# EAGLE design IsNoTeensy++ v1.0 (EAGLE 6.1)
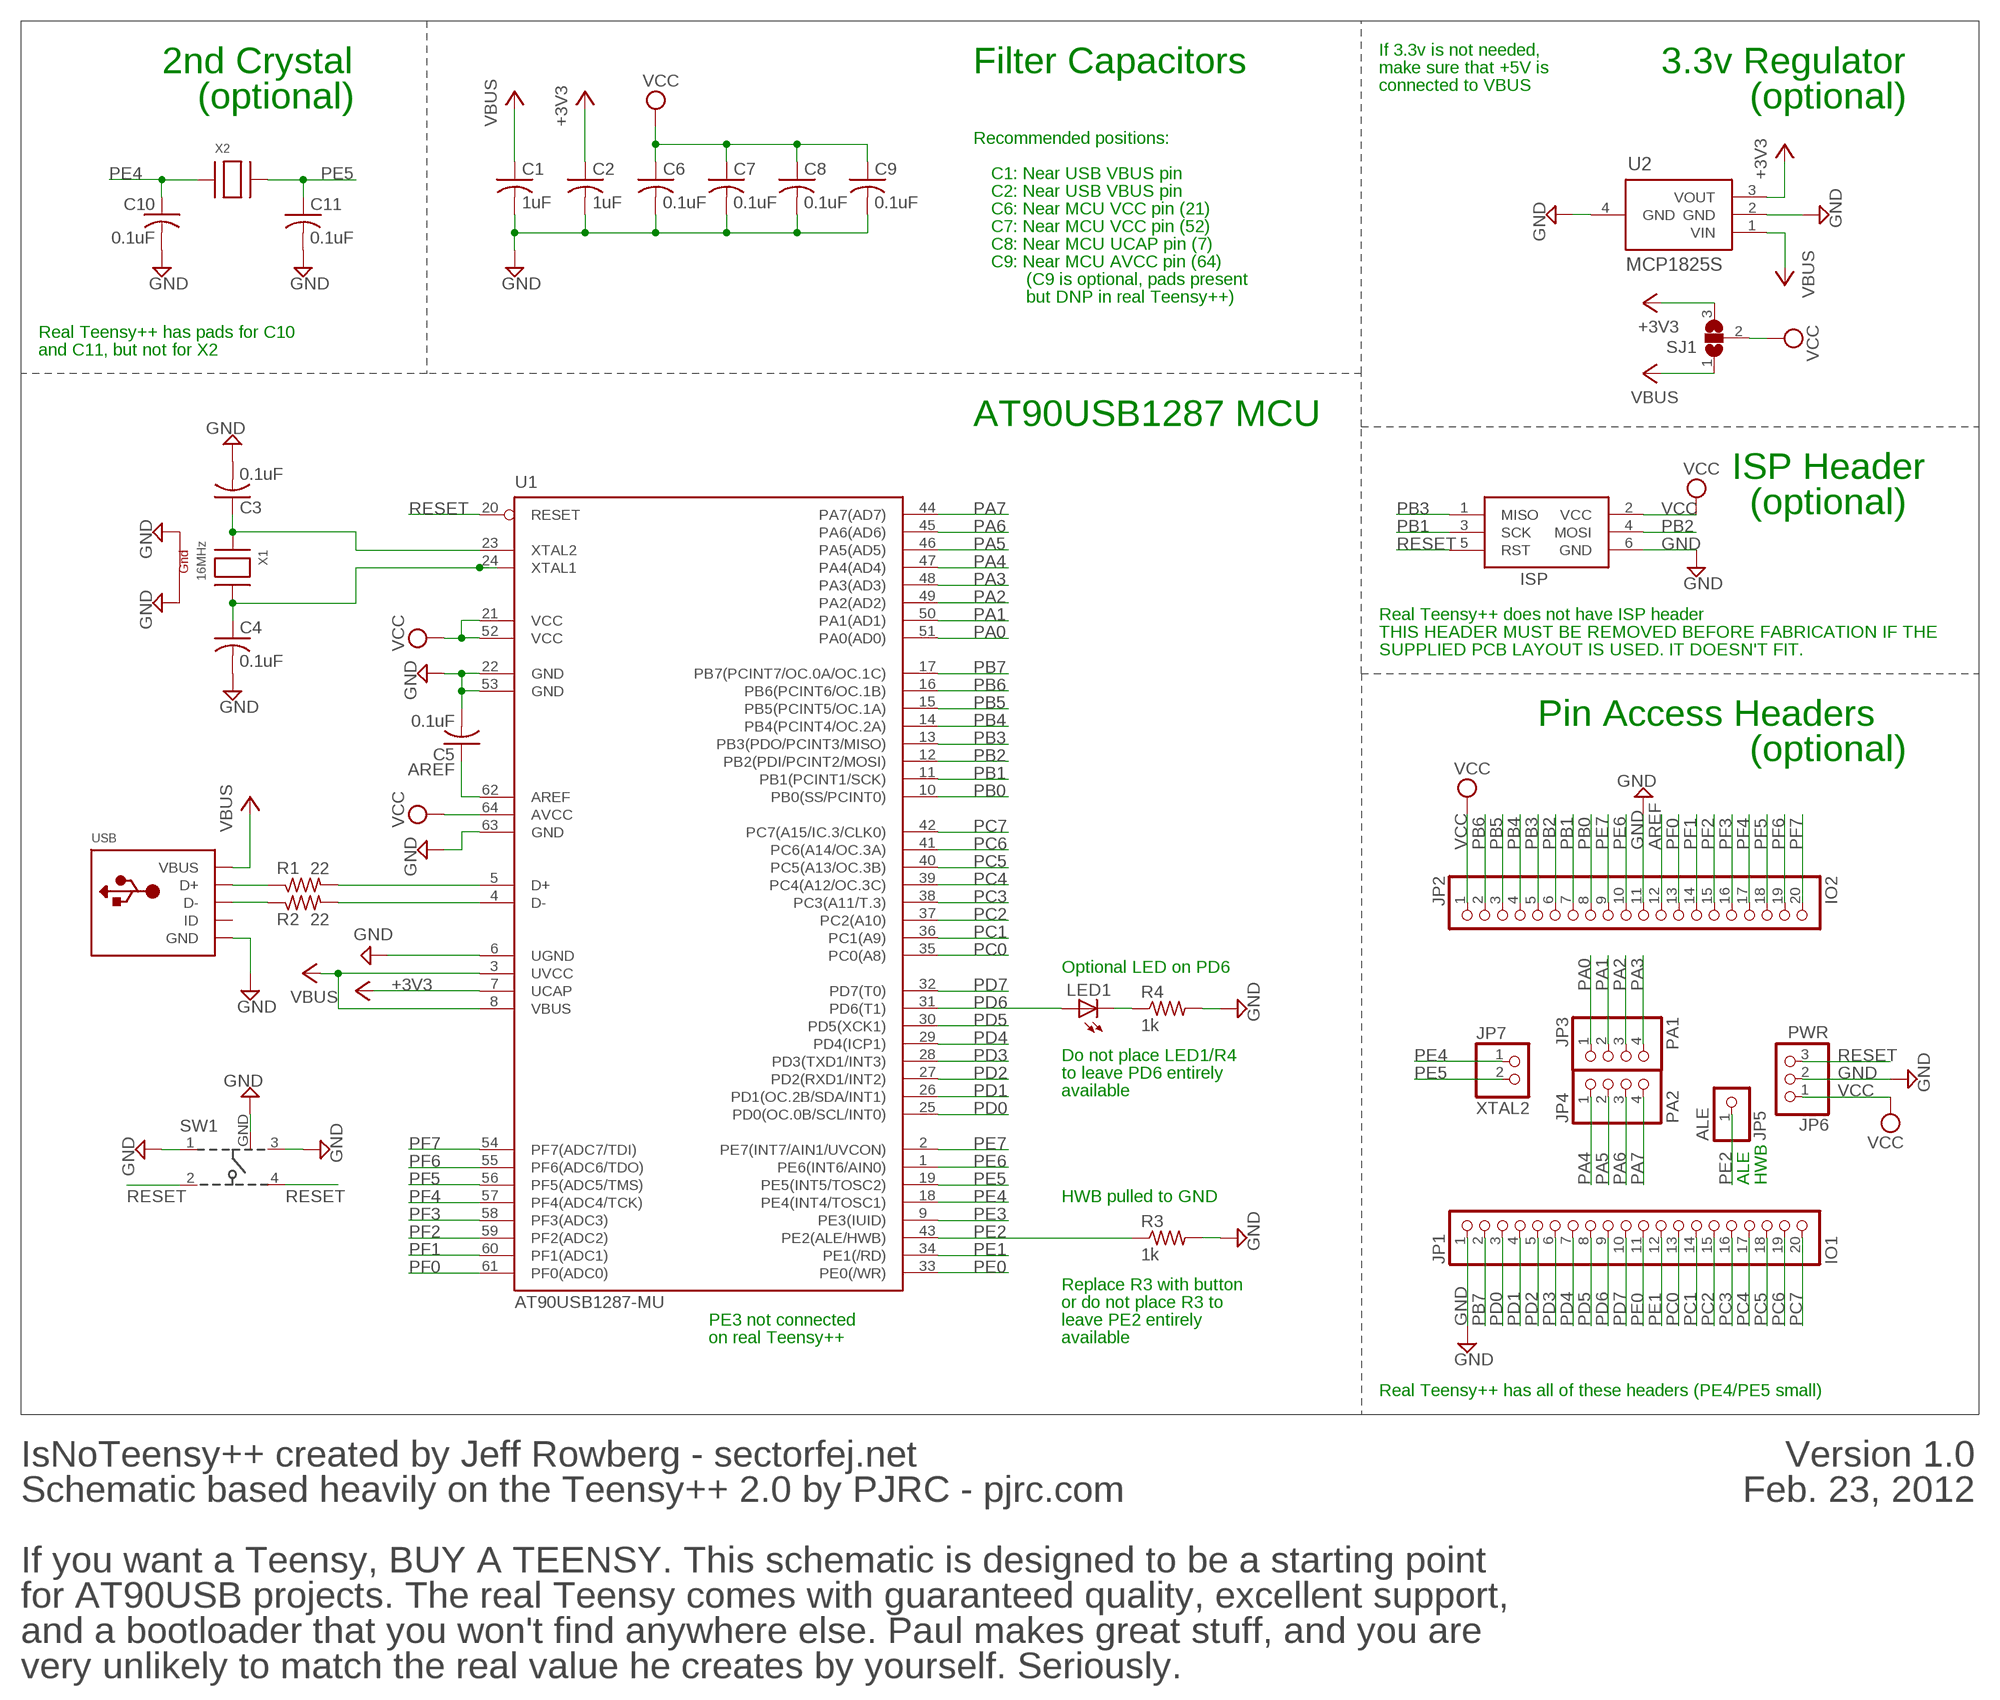
[diagram p0: schematic, sheet 1]

## Parts
C1  1uF  C-USC0603  [C0603]
C2  1uF  C-USC0603  [C0603]
C3  0.1uF  C-USC0402  [C0402]
C4  0.1uF  C-USC0402  [C0402]
C5  0.1uF  C-USC0402  [C0402]
C6  0.1uF  C-USC0402  [C0402]
C7  0.1uF  C-USC0402  [C0402]
C8  0.1uF  C-USC0402  [C0402]
C9  0.1uF  C-USC0805  [C0805]
C10  0.1uF  C-USC0805  [C0805]
C11  0.1uF  C-USC0805  [C0805]
ISP  AVRISP-6  [AVRISP]
JP1  IO1  PINHD-1X20  [1X20]
JP2  IO2  PINHD-1X20  [1X20]
JP3  PA1  PINHD-1X4  [1X04]
JP4  PA2  PINHD-1X4  [1X04]
JP5  ALE  PINHD-1X1  [1X01]
JP6  PWR  PINHD-1X3  [1X03]
JP7  XTAL2  PINHD-1X2  [1X02]
LED1  LEDCHIP-LED0603  [CHIP-LED0603]
R1  22  R-US_R0402  [R0402]
R2  22  R-US_R0402  [R0402]
R3  1k  R-US_R0402  [R0402]
R4  1k  R-US_R0402  [R0402]
SJ1  SJ2W  [SJ_2]
SW1  101-IG  [101-IG]
U1  AT90USB1287-MU  [MLF64]
U2  MCP1825S  [SOT223]
USB  USBMINIB  [USB-MINIB]
X1  16MHz  XTAL-4-3225  [NX3225]
X2  XTAL-3.2X1.5  [XTAL3215]

## Nets
+3V3: C2.1 SJ1.3 U1.7(UCAP) U2.3(VOUT)
AREF: C5.1 JP2.12 U1.62(AREF)
D+: R1.2 U1.5(D+)
D-: R2.2 U1.4(D-)
GND: C1.2 C2.2 C3.2 C4.2 C5.2 C6.2 C7.2 C8.2 C9.2 C10.2 C11.2 ISP.6(GND) JP1.1 JP2.11 JP6.2 R3.2 R4.2 SW1.1 SW1.3 SW1.GND U1.6(UGND) U1.22(GND) U1.53(GND) U1.63(GND) U2.2(GND) U2.4(GND) USB.GND USB.GND1(GND) USB.GND2(GND) USB.GND3(GND) USB.GND4(GND) X1.2(G1) X1.4(G2)
N$2: LED1.C R4.1
N$5: R1.1 USB.D+
N$14: R2.1 USB.D-
N$17: C4.1 U1.24(XTAL1) X1.3(X2)
N$18: C3.1 U1.23(XTAL2) X1.1(X1)
PA0: JP3.1 U1.51(PA0(AD0))
PA1: JP3.2 U1.50(PA1(AD1))
PA2: JP3.3 U1.49(PA2(AD2))
PA3: JP3.4 U1.48(PA3(AD3))
PA4: JP4.1 U1.47(PA4(AD4))
PA5: JP4.2 U1.46(PA5(AD5))
PA6: JP4.3 U1.45(PA6(AD6))
PA7: JP4.4 U1.44(PA7(AD7))
PB0: JP2.8 U1.10(PB0(SS/PCINT0))
PB1: ISP.3(SCK) JP2.7 U1.11(PB1(PCINT1/SCK))
PB2: ISP.4(MOSI) JP2.6 U1.12(PB2(PDI/PCINT2/MOSI))
PB3: ISP.1(MISO) JP2.5 U1.13(PB3(PDO/PCINT3/MISO))
PB4: JP2.4 U1.14(PB4(PCINT4/OC.2A))
PB5: JP2.3 U1.15(PB5(PCINT5/OC.1A))
PB6: JP2.2 U1.16(PB6(PCINT6/OC.1B))
PB7: JP1.2 U1.17(PB7(PCINT7/OC.0A/OC.1C))
PC0: JP1.13 U1.35(PC0(A8))
PC1: JP1.14 U1.36(PC1(A9))
PC2: JP1.15 U1.37(PC2(A10))
PC3: JP1.16 U1.38(PC3(A11/T.3))
PC4: JP1.17 U1.39(PC4(A12/OC.3C))
PC5: JP1.18 U1.40(PC5(A13/OC.3B))
PC6: JP1.19 U1.41(PC6(A14/OC.3A))
PC7: JP1.20 U1.42(PC7(A15/IC.3/CLK0))
PD0: JP1.3 U1.25(PD0(OC.0B/SCL/INT0))
PD1: JP1.4 U1.26(PD1(OC.2B/SDA/INT1))
PD2: JP1.5 U1.27(PD2(RXD1/INT2))
PD3: JP1.6 U1.28(PD3(TXD1/INT3))
PD4: JP1.7 U1.29(PD4(ICP1))
PD5: JP1.8 U1.30(PD5(XCK1))
PD6: JP1.9 LED1.A U1.31(PD6(T1))
PD7: JP1.10 U1.32(PD7(T0))
PE0: JP1.11 U1.33(PE0(/WR))
PE1: JP1.12 U1.34(PE1(/RD))
PE2: JP5.1 R3.1 U1.43(PE2(ALE/HWB))
PE3: U1.9(PE3(IUID))
PE4: C10.1 JP7.1 U1.18(PE4(INT4/TOSC1)) X2.P$1
PE5: C11.1 JP7.2 U1.19(PE5(INT5/TOSC2)) X2.P$2
PE6: JP2.10 U1.1(PE6(INT6/AIN0))
PE7: JP2.9 U1.2(PE7(INT7/AIN1/UVCON))
PF0: JP2.13 U1.61(PF0(ADC0))
PF1: JP2.14 U1.60(PF1(ADC1))
PF2: JP2.15 U1.59(PF2(ADC2))
PF3: JP2.16 U1.58(PF3(ADC3))
PF4: JP2.17 U1.57(PF4(ADC4/TCK))
PF5: JP2.18 U1.56(PF5(ADC5/TMS))
PF6: JP2.19 U1.55(PF6(ADC6/TDO))
PF7: JP2.20 U1.54(PF7(ADC7/TDI))
RESET: ISP.5(RST) JP6.3 SW1.2 SW1.4 U1.20(RESET)
VBUS: C1.1 SJ1.1 U1.3(UVCC) U1.8(VBUS) U2.1(VIN) USB.VBUS
VCC: C6.1 C7.1 C8.1 C9.1 ISP.2(VCC) JP2.1 JP6.1 SJ1.2 U1.21(VCC) U1.52(VCC) U1.64(AVCC)
Unconnected: USB.ID

## Notes on the sheet
- If 3.3v is not needed,
- 2nd Crystal | Filter Capacitors | make sure that +5V is | 3.3v Regulator
- connected to VBUS
- (optional) | (optional)
- Recommended positions:
- C1: Near USB VBUS pin
- C2: Near USB VBUS pin
- C6: Near MCU VCC pin (21)
- C7: Near MCU VCC pin (52)
- C8: Near MCU UCAP pin (7)
- C9: Near MCU AVCC pin (64)
- (C9 is optional, pads present
- but DNP in real Teensy++)
- Real Teensy++ has pads for C10
- and C11, but not for X2
- AT90USB1287 MCU
- ISP Header
- (optional)
- Real Teensy++ does not have ISP header
- THIS HEADER MUST BE REMOVED BEFORE FABRICATION IF THE
- SUPPLIED PCB LAYOUT IS USED. IT DOESN'T FIT.
- Pin Access Headers
- (optional)
- Optional LED on PD6
- Do not place LED1/R4
- to leave PD6 entirely
- available
- ALE | HWB
- HWB pulled to GND
- Replace R3 with button
- or do not place R3 to
- PE3 not connected | leave PE2 entirely
- on real Teensy++ | available
- Real Teensy++ has all of these headers (PE4/PE5 small)
- Version 1.0
- IsNoTeensy++ created by Jeff Rowberg - sectorfej.net | Feb. 23, 2012
- Schematic based heavily on the Teensy++ 2.0 by PJRC - pjrc.com
- If you want a Teensy, BUY A TEENSY. This schematic is designed to be a starting point
- for AT90USB projects. The real Teensy comes with guaranteed quality, excellent support,
- and a bootloader that you won't find anywhere else. Paul makes great stuff, and you are
- very unlikely to match the real value he creates by yourself. Seriously.

## Library data of the parts
C1-C11 = resistor:C-US: CAPACITOR, American symbol
ISP = adafruit:AVRISP: AVR ISP HEADER Standard 6 pin header for AVR programming
JP1 JP2 = sf-pinhead:PINHD-1X20: PIN HEADER
JP3 JP4 = sf-pinhead:PINHD-1X4: PIN HEADER
JP5 = sf-pinhead:PINHD-1X1: PIN HEADER
JP6 = sf-pinhead:PINHD-1X3: PIN HEADER
JP7 = sf-pinhead:PINHD-1X2: PIN HEADER
LED1 = led:LED: LED OSRAM: - CHIPLED LG R971, LG N971, LY N971, LG Q971, LY Q971, LO R971, LY R971 LH N974, LH R974 LS Q976, LO Q976, LY Q976 LO Q996 - Hyper CHIPLED LW Q18S LB Q993, LB Q99A, LB R99A - SideLED LS A670, LO A670, LY A670, LG A670, LP A670 LB A673, LV A673, LT A673, LW A673 LH A674 LY A675 LS A676, LA A676, LO A676, LY A676, LW A676 LS A679, LY A679, LG A679 - Hyper Micro SIDELED® LS Y876, LA Y876, LO Y876, LY Y876 LT Y87S - SmartLED LW L88C, LW L88S LB L89C, LB L89S, LG L890 LS L89K, LO L89K, LY L89K LS L896, LA L896, LO L896, LY L896 - TOPLED LS T670, LO T670, LY T670, LG T670, LP T670 LSG T670, LSP T670, LSY T670, LOP T670, LYG T670 LG T671, LOG T671, LSG T671 LB T673, LV T673, LT T673, LW T673 LH T674 LS T676, LA T676, LO T676, LY T676, LB T676, LH T676, LSB T676, LW T676 LB T67C, LV T67C, LT T67C, LS T67K, LO T67K, LY T67K, LW E67C LS E67B, LA E67B, LO E67B, LY E67B, LB E67C, LV E67C, LT E67C LW T67C LS T679, LY T679, LG T679 LS T770, LO T770, LY T770, LG T770, LP T770 LB T773, LV T773, LT T773, LW T773 LH T774 LS E675, LA E675, LY E675, LS T675 LS T776, LA T776, LO T776, LY T776, LB T776 LHGB T686 LT T68C, LB T68C - Hyper Mini TOPLED® LB M676 - Mini TOPLED Santana® LG M470 LS M47K, LO M47K, LY M47K Source: http://www.osram.convergy.de LUXEON: - LUMILED® LXK2-PW12-R00, LXK2-PW12-S00, LXK2-PW14-U00, LXK2-PW14-V00 LXK2-PM12-R00, LXK2-PM12-S00, LXK2-PM14-U00 LXK2-PE12-Q00, LXK2-PE12-R00, LXK2-PE12-S00, LXK2-PE14-T00, LXK2-PE14-U00 LXK2-PB12-K00, LXK2-PB12-L00, LXK2-PB12-M00, LXK2-PB14-N00, LXK2-PB14-P00, LXK2-PB14-Q00 LXK2-PR12-L00, LXK2-PR12-M00, LXK2-PR14-Q00, LXK2-PR14-R00 LXK2-PD12-Q00, LXK2-PD12-R00, LXK2-PD12-S00 LXK2-PH12-R00, LXK2-PH12-S00 LXK2-PL12-P00, LXK2-PL12-Q00, LXK2-PL12-R00 Source: www.luxeon.com KINGBRIGHT: KA-3528ASYC Source: www.kingbright.com
R1-R4 = resistor:R-US_: RESISTOR, American symbol
SJ1 = jumper:SJ2W: SMD solder JUMPER
SW1 = sf-keyglove:101-IG
U1 = at90usb:AT90USB1287-*: Atmel AT90USB1287 AVR Microcontroller with USB Interface and 128kB Flash Memory
U2 = sf-keyglove:MCP1825S
USB = adafruit:USB: USB Connectors USBMINIB - Surface Mount Female Mini-B USB Connector 4UConnector: 06564 By microbuilder.eu Thru-hole RA Female Mini-B USB Connector 4UConnector: 18732 By ladyada.net
X1 = adafruit:XTAL-4: Classic 4-pin 3.2 x 2.5mm crystal
X2 = adafruit:XTAL: Low cost SMT crystals, no capacitors included http://www.ladyada.net/library/eagle

## Net classes
0 default: width 0.152 mm, drill 0.33 mm, clearance 0.152 mm

## Board
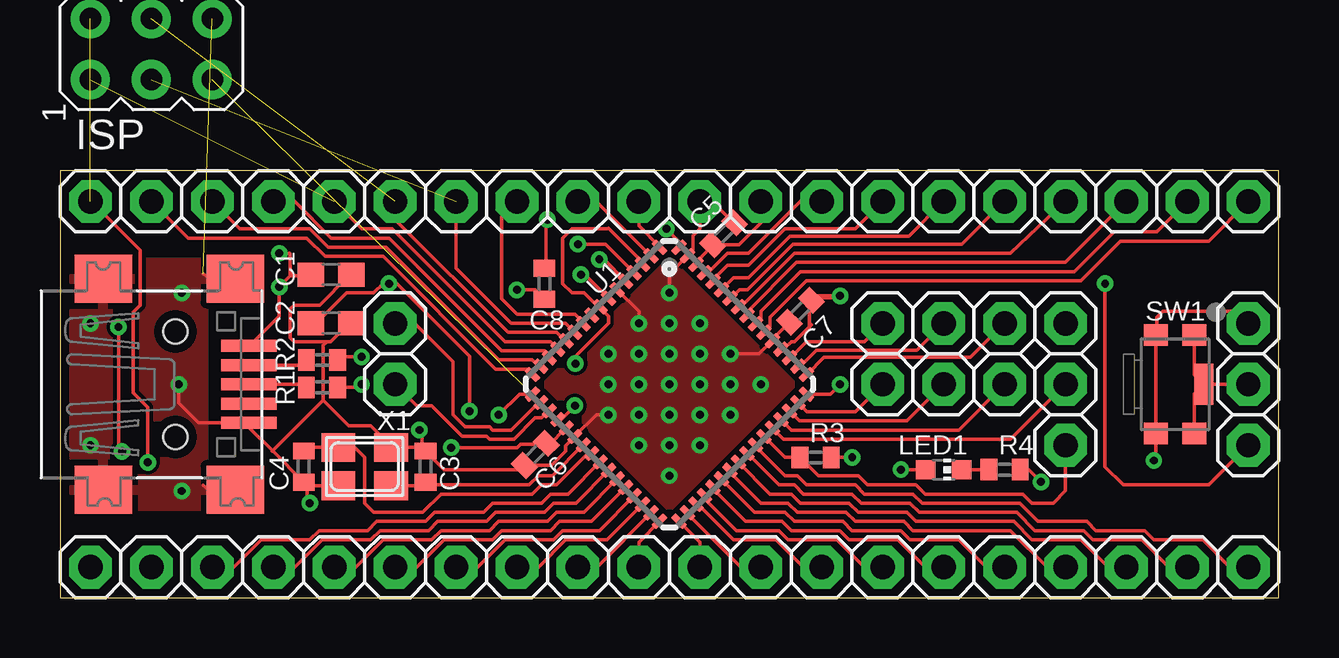
[diagram p1: board, top side]
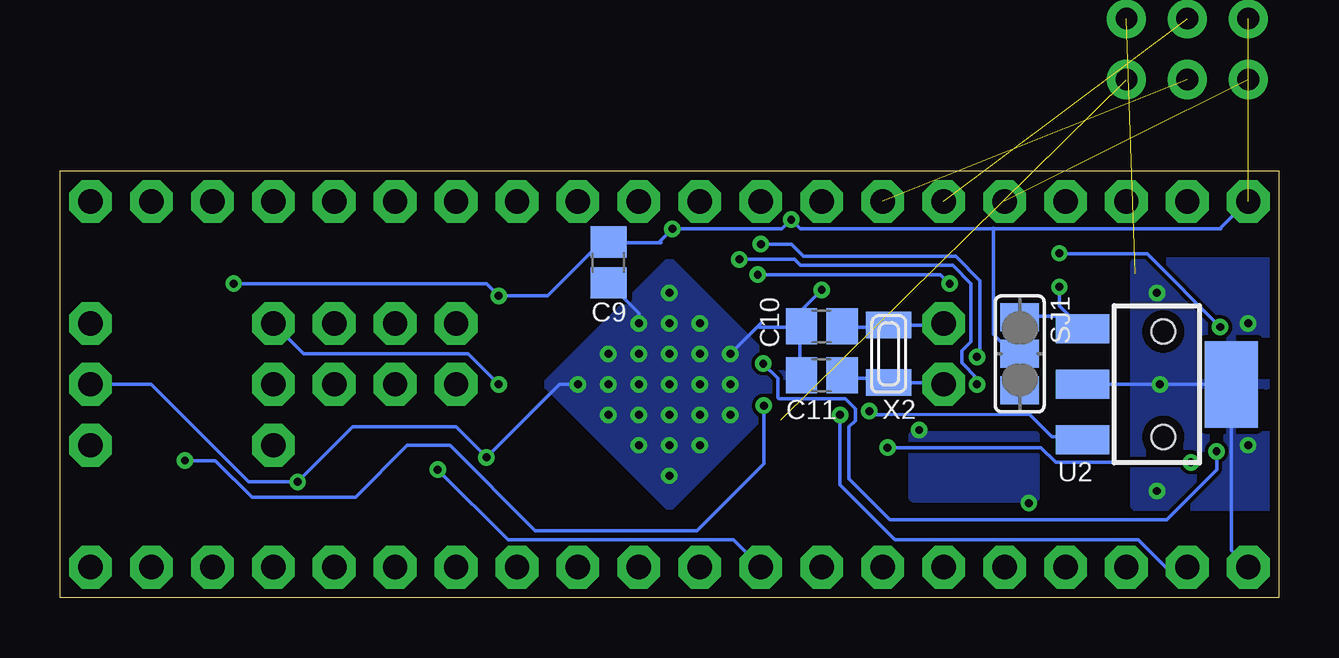
[diagram p2: board, bottom side, seen from below]

Size 50.8 x 17.78 mm. Coordinates in mm from the lower left corner, seen from the top.
Outline: 0,0 50.8,0 50.8,17.78 0,17.78 0,0
Copper layers (1*16): Top 0.0356mm / dielectric 1.5011mm / Bottom 0.0356mm
Design rules: minimum track width 6mil, minimum drill 13mil, track to track 6mil, track to pad 6mil, pad to pad 6mil, via to via 6mil, smd to smd 6mil, copper to edge 15mil, drill to drill 6mil, minimum pad ring 7mil, minimum via ring 7mil, stop-mask expansion 4mil, vias tented up to drill 20mil, thermal gap 10mil

### Footprints (pad centres in the part's own frame; a part is rotated, then mirrored left to right if it is on the bottom)
C0603 = smd 1.1 x 1: 1 -0.85,0; 2 0.85,0
C0402 = smd 0.7 x 0.9: 1 -0.65,0; 2 0.65,0
C0805 = smd 1.3 x 1.5: 1 -0.85,0; 2 0.85,0
AVRISP = drill 0.9 pad 1.626: 1 -1.27,2.54; 2 1.27,2.54; 3 -1.27,0; 4 1.27,0; 5 -1.27,-2.54; 6 1.27,-2.54
1X20 = drill 1.016 pad 1.778 octagon: 1 -24.13,0; 2 -21.59,0; 3 -19.05,0; 4 -16.51,0; 5 -13.97,0; 6 -11.43,0; 7 -8.89,0; 8 -6.35,0; 9 -3.81,0; 10 -1.27,0; 11 1.27,0; 12 3.81,0; 13 6.35,0; 14 8.89,0; 15 11.43,0; 16 13.97,0; 17 16.51,0; 18 19.05,0; 19 21.59,0; 20 24.13,0
1X04 = drill 1.016 pad 1.778 octagon: 1 -3.81,0; 2 -1.27,0; 3 1.27,0; 4 3.81,0
1X01 = drill 1.016 pad 1.778 octagon: 1 0,0
1X03 = drill 1.016 pad 1.778 octagon: 1 -2.54,0; 2 0,0; 3 2.54,0
1X02 = drill 1.016 pad 1.778 octagon: 1 -1.27,0; 2 1.27,0
CHIP-LED0603 = smd 0.8 x 0.8: A 0,-0.75; C 0,0.75
R0402 = smd 0.7 x 0.9: 1 -0.65,0; 2 0.65,0
SJ_2 = smd 1.168 x 1.6: 1 -1.524,0; 2 0,0; 3 1.524,0
101-IG = smd 0.9 x 1: 1 -2.05,0.8; 2 -2.05,-0.8; 3 2.05,0.8; 4 2.05,-0.8 | smd 1.7 x 0.8: GND 0,1.2
MLF64 = smd 0.7 x 0.3: 1 -4.325,3.75; 2 -4.325,3.25; 3 -4.325,2.75; 4 -4.325,2.25; 5 -4.325,1.75; 6 -4.325,1.25; 7 -4.325,0.75; 8 -4.325,0.25; 9 -4.325,-0.25; 10 -4.325,-0.75; 11 -4.325,-1.25; 12 -4.325,-1.75; 13 -4.325,-2.25; 14 -4.325,-2.75; 15 -4.325,-3.25; 16 -4.325,-3.75; 33 4.325,-3.75; 34 4.325,-3.25; 35 4.325,-2.75; 36 4.325,-2.25; 37 4.325,-1.75; 38 4.325,-1.25; 39 4.325,-0.75; 40 4.325,-0.25; 41 4.325,0.25; 42 4.325,0.75; 43 4.325,1.25; 44 4.325,1.75; 45 4.325,2.25; 46 4.325,2.75; 47 4.325,3.25; 48 4.325,3.75 | smd 0.3 x 0.7: 17 -3.75,-4.325; 18 -3.25,-4.325; 19 -2.75,-4.325; 20 -2.25,-4.325; 21 -1.75,-4.325; 22 -1.25,-4.325; 23 -0.75,-4.325; 24 -0.25,-4.325; 25 0.25,-4.325; 26 0.75,-4.325; 27 1.25,-4.325; 28 1.75,-4.325; 29 2.25,-4.325; 30 2.75,-4.325; 31 3.25,-4.325; 32 3.75,-4.325; 49 3.75,4.325; 50 3.25,4.325; 51 2.75,4.325; 52 2.25,4.325; 53 1.75,4.325; 54 1.25,4.325; 55 0.75,4.325; 56 0.25,4.325; 57 -0.25,4.325; 58 -0.75,4.325; 59 -1.25,4.325; 60 -1.75,4.325; 61 -2.25,4.325; 62 -2.75,4.325; 63 -3.25,4.325; 64 -3.75,4.325
SOT223 = smd 1.219 x 2.235: 1 -2.311,-3.099; 2 0,-3.099; 3 2.311,-3.099 | smd 3.6 x 2.2: 4 0,3.099
USB-MINIB = smd 0.5 x 2.308: D+ 0,4.064; D- -0.8,4.064; GND 1.6,4.064; ID 0.8,4.064; VBUS -1.6,4.064 | smd 2 x 2.4: GND1 -4.4,-2; GND2 -4.4,3.5; GND3 4.4,3.5; GND4 4.4,-2 | hole 1: -2.2,1; 2.2,1
NX3225 = smd 1.4 x 1.2: 1 -1.1,0.8; 2 1.1,0.8; 3 1.1,-0.8; 4 -1.1,-0.8
XTAL3215 = smd 1.1 x 1.9: P$1 1.2,0; P$2 -1.2,0

### Placement (x,y rotation side)
C1  11.3,13.46 0 top
C2  11.3,11.43 0 top
C3  15.24,5.46 90 top
C4  10.16,5.46 270 top
C5  27.66,15.16 45 top
C6  19.81,5.97 225 top
C7  30.86,11.94 225 top
C8  20.19,13.08 270 top
C9  27.94,13.97 270 bottom
C10  19.05,11.3 180 bottom
C11  19.05,9.27 180 bottom
ISP  3.81,22.86 90 top  (outside the outline)
JP1  25.4,1.27 0 top
JP2  25.4,16.51 0 top
JP3  38.1,11.43 0 top
JP4  38.1,8.89 0 top
JP5  41.91,6.35 0 top
JP6  49.53,8.89 90 top
JP7  13.97,10.16 270 top
LED1  36.83,5.33 270 top
R1  10.92,8.76 0 top
R2  10.92,9.91 0 top
R3  31.5,5.84 0 top
R4  39.37,5.33 0 top
SJ1  10.79,10.16 270 bottom
SW1  46.48,8.89 270 top
U1  25.4,8.89 315 top
U2  5.08,8.89 270 bottom
USB  3.81,8.89 270 top
X1  12.7,5.46 180 top
X2  16.26,10.16 90 bottom

### Tracks (layer width: path | path; a pad name or v marks a point on that pad's centre or on a via)
+3V3  (via drill 0.33)
  Top 0.152: U1.7 21.89,13.46 v21.72,13.46 | C2.1 10.67,11.43 11.94,12.7 13.08,12.7 13.46,13.08 v13.72,13.08 14.05,13.08 17.07,10.06 v17.07,7.77
  Bottom 0.152: 7.52,6.58 U2.3 8.23,6.71 9.45,6.71 10.39,7.64 10.79,7.64 | v21.72,13.46 14.1,13.46 v13.72,13.08 | v17.07,7.77 16.92,7.62 16.51,7.62 10.79,7.64 | SJ1.3 | SJ1.3 10.79,7.64
AREF
  Top 0.152: U1.62 26.51,13.94 C5.1 28.29,14.7 29.21,15.62 JP2.12
D+  (via drill 0.33)
  Top 0.152: 22.54,14.22 v22.48,14.1 22.67,14.1 U1.5 | R1.2 12.32,8.76 v12.57,8.89
  Bottom 0.152: v12.57,8.89 12.57,9.14 13.21,9.78 13.21,10.29 12.83,10.67 12.83,13.08 13.59,13.84 19.94,13.84 20.19,14.1 v22.48,14.1
D-  (via drill 0.33)
  Top 0.152: U1.4 22.74,14.73 v21.59,14.73 | R2.2 11.7,10.03 v12.57,10.03
  Bottom 0.152: v12.57,10.03 12.45,10.16 12.45,13.21 13.46,14.22 19.81,14.22 20.32,14.73 v21.59,14.73
GND  (via drill 0.33)  (1 unrouted)
  Top 0.152: JP6.2 SW1.GND | SW1.GND 47.68,8.84 | R4.2 40.39,5.33 v40.89,4.83 | R3.2 v33.02,5.84 | SW1.1 47.28,9.29 SW1.GND | SW1.3 47.28,8.49 SW1.GND | v27.94,10.16 29.14,10.16 U1.53 29.7,10.77 C7.2 | C5.2 28.11,15.57 27.18,16.51 JP2.11 26.67,15.37 26.39,15.09 26.39,14.5 U1.63 25.4,13.49 v25.4,12.7 | v22.86,7.62 22.36,7.62 U1.22 21.08,6.34 21.08,6.1 20.5,5.51 C6.2 19.53,5.33 16.02,5.33 C3.2 15.09,6.26 | 10.31,4.66 C4.2 8.86,6.11 | 10.31,4.66 X1.2 11.9,4.66 | U1.6 24.13,11.93 v24.13,11.43 | C8.2 19.8,12.83 v19.05,12.83 | v4.95,8.89 4.95,8.13 5.79,7.29 USB.GND 7.87,7.1 8.86,6.11 | X1.4 15.09,6.26 | 13.21,5.97 13.51,5.97 X1.4 | 15.09,6.26 15.09,6.83 v14.99,6.99 | 11.12,10.67 11.28,10.67 12.04,11.43 C2.2 | 11.12,10.67 10.97,10.52 10.97,8.23 | 8.86,6.11 10.97,8.23 | 8.84,6.1 8.86,6.11 | 11.12,10.67 9.75,10.67 9.6,10.82 9.6,12.04 9.75,12.19 10.82,12.19 12.04,13.41 C1.2 | 10.31,4.66 10.31,4.04 v10.41,3.94 | 10.97,8.23 12.04,7.16 12.95,7.16 13.72,6.4 X1.4 | USB.GND3 7.16,4.57 6.1,4.57 5.97,4.69 | 5.97,13.49 6.1,13.41 7.16,13.41 USB.GND2
  Bottom 0.152: JP6.2 46.99,8.89 42.93,4.83 v40.89,4.83 38.61,7.11 34.29,7.11 v33.02,5.84 29.97,8.89 v29.21,8.89 | C9.2 26.67,11.85 v26.67,11.43 | JP1.1 1.98,1.98 U2.4 v4.95,8.89 U2.2 | 21.59,11.43 21.69,11.33 | 21.69,11.33 v22.86,10.16 | v19.05,12.83 19.9,11.98 C10.2 19.96,11.28 | 19.96,11.28 19.96,9.3 C11.2 | 19.96,11.28 21.64,11.28 21.69,11.33
  other vias: 24.13,8.89 25.4,11.43 26.67,10.16 25.4,10.16 24.13,10.16 22.86,8.89 25.4,8.89 26.67,8.89 27.94,8.89 27.94,7.62 26.67,7.62 25.4,7.62 24.13,7.62 24.13,6.35 25.4,6.35 26.67,6.35 25.4,5.08 5.08,4.45 5.08,12.7 1.27,11.43 1.27,6.35
  pour Bottom: 20.32,8.89 25.4,13.97 30.48,8.89 25.4,3.81
  pour Top: 20.32,8.89 25.4,13.97 30.48,8.89 25.4,3.81
  pour Bottom: 10.16,6.73 15.24,6.73 15.24,4.19 10.16,4.19
  pour Bottom: 0,13.97 0,3.81 5.97,3.81 5.97,13.97
  pour Top: 0,3.81 0,13.97 5.97,13.97 5.97,3.81
N$2
  Top 0.152: R4.1 LED1.C
N$3
  Bottom 0.152: 10.79,10.54 10.79,11.3
N$5
  Top 0.152: USB.D+ 10.14,8.89 R1.1
N$14
  Top 0.152: USB.D- 10.06,9.69 R2.1
N$17
  Top 0.152: C4.1 10.31,6.26 X1.3 | U1.24 22.01,6.01 20.7,4.7 20.07,4.7 19.68,4.32 15.88,4.32 15.11,3.56 13.08,3.56 12.7,3.94 12.7,5.84 12.32,6.22 11.64,6.22 X1.3 | X1.3
N$18
  Top 0.152: X1.1 15.09,4.66 C3.1 15.35,4.7 19.56,4.7 19.94,5.08 20.53,5.08 U1.23
PA0
  Top 0.152: U1.51 30.45,10 31.11,10.67 33.53,10.67 JP3.1
PA1
  Top 0.152: JP3.2 35.71,10.31 31.52,10.31 30.86,9.65 U1.50
PA2
  Top 0.152: JP3.3 37.95,10.01 31.85,10.01 31.14,9.3 U1.49
PA3  (via drill 0.33)
  Top 0.152: U1.48 32.1,8.48 v32.51,8.89
  Bottom 0.152: v32.51,8.89 33.78,10.16 40.64,10.16 JP3.4
PA4
  Top 0.152: U1.47 31.14,7.75 33.15,7.75 JP4.1
PA5
  Top 0.152: U1.46 30.81,7.37 35.31,7.37 JP4.2
PA6
  Top 0.152: U1.45 30.49,6.99 37.47,6.99 JP4.3
PA7
  Top 0.152: U1.44 30.16,6.6 39.62,6.6 JP4.4
PB0
  Top 0.152: JP2.8 18.41,15.88 18.41,12.45 19.05,11.81 21.46,11.81 21.81,11.46 U1.10
PB1  (1 unrouted)
  Top 0.152: JP2.7 16.51,13.72 18.8,11.43 21.08,11.43 21.45,11.06 U1.11
PB2  (1 unrouted)
  Top 0.152: JP2.6 13.97,15.75 18.67,11.05 20.7,11.05 21.04,10.71 U1.12
PB3  (1 unrouted)
  Top 0.152: JP2.5 12.57,15.37 13.84,15.37 18.54,10.67 20.45,10.67 U1.13
PB4
  Top 0.152: JP2.4 9.78,16.51 11.3,14.99 13.72,14.99 18.41,10.29 20.19,10.29 20.32,10.16 | 20.32,10.16 20.45,10.03 | U1.14 20.32,10.08 20.32,10.16
PB5
  Top 0.152: JP2.3 7.49,15.37 10.41,15.37 11.18,14.61 13.59,14.61 18.29,9.91 19.68,9.91 19.94,9.65 U1.15
PB6
  Top 0.152: JP2.2 5.33,14.99 10.29,14.99 11.05,14.22 13.46,14.22 18.16,9.53 19.46,9.53 U1.16
PB7  (via drill 0.33)
  Top 0.152: U1.17 19.15,8.48 v18.29,7.62
  Bottom 0.152: JP1.2 4.7,1.27 5.84,2.41 16,2.41 18.29,4.7 v18.29,7.62
PC0
  Top 0.152: U1.35 26.59,3.89 28.07,2.41 29.84,2.41 30.99,1.27 JP1.13
PC1
  Top 0.152: U1.36 26.87,4.12 28.19,2.79 29.97,2.79 30.35,2.41 32.38,2.41 33.53,1.27 JP1.14
PC2
  Top 0.152: U1.37 27.22,4.53 28.57,3.17 30.1,3.17 30.48,2.79 32.51,2.79 32.89,2.41 34.92,2.41 36.07,1.27 JP1.15
PC3
  Top 0.152: U1.38 27.57,4.94 28.96,3.56 30.23,3.56 30.61,3.17 32.64,3.17 33.02,2.79 35.05,2.79 35.43,2.41 37.47,2.41 38.61,1.27 JP1.16
PC4
  Top 0.152: U1.39 27.85,5.3 29.21,3.94 30.35,3.94 30.73,3.56 32.77,3.56 33.15,3.17 35.18,3.17 35.56,2.79 39.62,2.79 41.15,1.27 JP1.17
PC5
  Top 0.152: U1.40 28.25,5.66 29.59,4.32 30.48,4.32 30.86,3.94 32.89,3.94 33.27,3.56 35.31,3.56 35.69,3.17 39.75,3.17 40.51,2.41 42.55,2.41 43.69,1.27 JP1.18
PC6
  Top 0.152: U1.41 28.76,5.91 29.97,4.7 30.61,4.7 30.99,4.32 33.02,4.32 33.4,3.94 35.43,3.94 35.81,3.56 39.88,3.56 40.64,2.79 42.67,2.79 43.05,2.41 45.09,2.41 46.23,1.27 JP1.19
PC7
  Top 0.152: U1.42 28.99,6.32 30.23,5.08 30.73,5.08 31.11,4.7 33.15,4.7 33.53,4.32 35.56,4.32 35.94,3.94 40.01,3.94 40.77,3.17 42.8,3.17 43.18,2.79 45.21,2.79 45.59,2.41 47.62,2.41 48.77,1.27 JP1.20
PD0
  Top 0.152: U1.25 21.18,4.32 20.45,4.32 20.07,3.94 18.03,3.94 17.65,3.56 15.62,3.56 15.24,3.17 13.21,3.17 12.83,2.79 10.79,2.79 10.41,2.41 8.38,2.41 7.24,1.27 JP1.3
PD1
  Top 0.152: U1.26 21.51,3.94 20.57,3.94 20.19,3.56 18.16,3.56 17.78,3.17 15.75,3.17 15.37,2.79 13.34,2.79 12.95,2.41 10.92,2.41 9.78,1.27 JP1.4
PD2
  Top 0.152: U1.27 21.83,3.56 20.7,3.56 20.32,3.17 18.29,3.17 17.91,2.79 15.88,2.79 15.49,2.41 13.46,2.41 12.32,1.27 JP1.5
PD3
  Top 0.152: U1.28 22.16,3.17 20.83,3.17 20.45,2.79 18.41,2.79 18.03,2.41 16,2.41 14.86,1.27 JP1.6
PD4
  Top 0.152: U1.29 22.49,2.79 20.95,2.79 20.57,2.41 18.54,2.41 17.4,1.27 JP1.7
PD5
  Top 0.152: U1.30 22.81,2.41 21.08,2.41 19.94,1.27 JP1.8
PD6  (via drill 0.33)
  Top 0.152: LED1.A v35.05,5.33 | U1.31 22.38,1.27 JP1.9
  Bottom 0.152: v35.05,5.33 32.13,2.41 22.73,2.41 JP1.9
PD7
  Top 0.152: U1.32 24.13,2.32 JP1.10
PE0
  Top 0.152: U1.33 26.67,2.32 JP1.11
PE1
  Top 0.152: U1.34 26.29,3.37 28.38,1.27 JP1.12
PE2
  Top 0.152: U1.43 30.22,5.84 R3.1 31.61,5.08 33.27,5.08 33.66,4.7 35.69,4.7 36.07,4.32 40.13,4.32 40.51,3.94 41.4,3.94 41.91,4.45 JP5.1
PE4
  Top 0.152: U1.18 19.94,8.13 18.8,6.99 18.03,6.99 17.91,7.11 16.89,7.11 16.38,7.62 16.38,9.84 14.86,11.36 14.04,11.36 JP7.1
  Bottom 0.152: X2.P$1 16.33,11.43 | JP7.1 14.04,11.36 X2.P$1 | C10.1 18.14,11.28 16.31,11.28 X2.P$1
PE5
  Top 0.152: U1.19 20.35,7.78 20.07,7.49 19.81,7.49 18.92,6.6 17.91,6.6 17.78,6.73 16.76,6.73 15.49,8 14.86,8 JP7.2
  Bottom 0.152: X2.P$2 16.33,8.89 | JP7.2 14.04,8.96 X2.P$2 | C11.1 18.14,9.14 16.46,9.14 16.31,8.99 X2.P$2
PE6
  Top 0.152: U1.1 24.99,14.63 24.13,15.49 JP2.10
PE7
  Top 0.152: U1.2 24.62,14.25 22.35,16.51 JP2.9
PF0
  Top 0.152: U1.61 27,13.54 27.81,14.35 28.7,14.35 30.86,16.51 JP2.13
PF1
  Top 0.152: U1.60 27.22,13.25 27.81,13.84 28.7,13.84 30.23,15.37 33.15,15.37 JP2.14
PF2
  Top 0.152: U1.59 27.57,12.84 28.07,13.34 28.7,13.34 30.43,15.06 35.38,15.06 JP2.15
PF3
  Top 0.152: JP2.16 37.59,14.73 30.56,14.73 28.65,12.83 28.32,12.83 27.97,12.48 U1.58
PF4
  Top 0.152: JP2.17 39.62,14.35 30.61,14.35 28.38,12.12 U1.57
PF5
  Top 0.152: JP2.18 41.91,13.97 30.71,13.97 28.64,11.9 U1.56
PF6
  Top 0.152: U1.55 29.21,11.64 29.21,11.94 30.86,13.59 42.29,13.59 43.94,15.24 45.72,15.24 JP2.19
PF7
  Top 0.152: U1.54 29.59,11.31 29.59,11.68 31.11,13.21 42.55,13.21 44.2,14.86 47.88,14.86 JP2.20
RESET  (via drill 0.33)  (1 unrouted)
  Top 0.152: JP6.3 49.02,11.94 45.97,11.94 45.72,11.68 45.72,10.97 SW1.2 SW1.4 45.68,5.8 v45.59,5.71 | v21.46,8 20.89,7.42 U1.20
  Bottom 0.152: v45.59,5.71 44.32,5.71 42.8,4.19 38.48,4.19 36.32,6.35 34.54,6.35 30.99,2.79 24.26,2.79 21.46,5.59 v21.46,8
VBUS  (via drill 0.33)
  Top 0.152: 7.77,10.36 USB.VBUS 7.92,10.52 9.14,11.73 v9.14,12.95 9.6,13.41 | v9.14,14.35 9.56,14.35 9.6,14.33 9.6,13.41 | v21.49,9.75 21.49,10.06 22.86,11.43 22.86,11.73 22.55,12.04 U1.8 22.42,12.12 21.84,12.7 21.34,12.7 20.95,13.08 20.95,14.99 21.34,15.37 22.81,15.37 22.86,15.39 24.23,14.02 U1.3 | v2.44,11.28 2.44,6.25 v2.59,6.1 | 9.65,13.46 9.6,13.41 | 9.6,13.41 10.36,13.41 C1.1
  Bottom 0.152: v21.49,9.75 20.88,9.14 20.88,8.33 20.83,8.28 18.06,8.28 17.65,7.87 17.65,7.37 17.91,7.11 17.91,4.95 16.2,3.25 4.67,3.25 2.59,5.33 v2.59,6.1 | v2.44,11.28 5.49,14.33 9.14,14.33 v9.14,14.35 | 8.23,11.28 U2.1 8.71,11.73 | SJ1.1 10.67,11.73 8.71,11.73 | 8.71,11.73 9.14,12.17 v9.14,12.95
VCC  (via drill 0.33)  (1 unrouted)
  Top 0.152: 30.17,10.36 30.18,10.36 | 30.18,10.36 30.48,10.67 30.61,10.67 31.23,11.29 | 31.23,11.29 31.32,11.38 | C6.1 20.46,6.43 | 31.23,11.29 31.24,11.28 31.24,12.34 C7.1 31.39,12.5 32.46,12.5 v32.51,12.57 31.5,12.57 | JP6.1 47.88,4.7 44.32,4.7 43.56,5.46 v43.56,13.08 | 20.19,15.62 20.27,15.7 | 25.81,14.83 | 25.81,14.83 v25.27,15.37 | v16.31,6.25 19.05,6.25 19.2,6.4 20.27,6.4 C6.1 | v3.66,5.64 3.66,7.92 3.05,8.53 3.05,11.89 3.35,12.19 3.35,14.48 1.37,16.46 JP2.1 | 30.18,10.36 U1.52 | U1.21 21.03,7.01 20.42,6.4 C6.1 | U1.64 25.76,14.63 25.76,14.78 25.81,14.83 | 20.27,15.7 20.27,13.87 C8.1 | 20.27,15.7 v20.32,15.75
  Bottom 0.152: v43.56,13.08 33.02,13.08 v32.51,12.57 30.48,12.57 28.23,14.82 28.19,14.78 28.04,14.78 C9.1 27.89,14.78 25.76,14.78 25.81,14.83 | 2.41,15.37 2.44,15.37 | 2.44,15.37 11.89,15.37 | 11.89,15.37 19.94,15.37 v20.32,15.75 20.7,15.37 v25.27,15.37 25.81,14.83 | 25.82,14.82 25.81,14.83 | 11.89,15.37 11.89,10.97 11.12,10.21 10.82,10.21 SJ1.2 | 11.89,15.39 11.89,15.37 | v16.31,6.25 9.91,6.25 9.3,5.64 v3.66,5.64 | 2.44,15.37 2.44,15.39 1.37,16.46 JP2.1

### Text on the board
tNames: X1
tDocu: +5V B6 B5 B4 B3 B2 B1 B0 E7 E6 | G R F0 F1 F2 F3 F4 F5 F6 F7 | PA0 PA1 PA2 PA3 | AT90USB1287 | E5 E4 | PA4 PA5 PA6 PA7 | GND B7 D0 D1 D2 D3 D4 D5 D6 D7 | E0 E1 C0 C1 C2 C3 C4 C5 C6 C7
bDocu: +5V | B6 | B5 | B4 | B3 | B2 | B1 | B0 | E7 | E6 | GND | AREF | F0 | F1 | F2 | F3 | F4 | F5 | F6 | F7 | 5V | E4 | PA3 PA2 PA1 PA0 | RST | GND | 3V | E5 | PA7 PA6 PA5 PA4 | ALE | +5V | HWB | GND | B7 | D0 | D1 | D2 | D3 | D4 | D5 | D6 | D7 | E0 | E1 | C0 | C1 | C2 | C3 | C4 | C5 | C6 | C7